# Altium schematic sheet 1_power.SchDoc: Power
size A4; DocumentNumber: 2; SheetNumber: 2; SheetTotal: 11
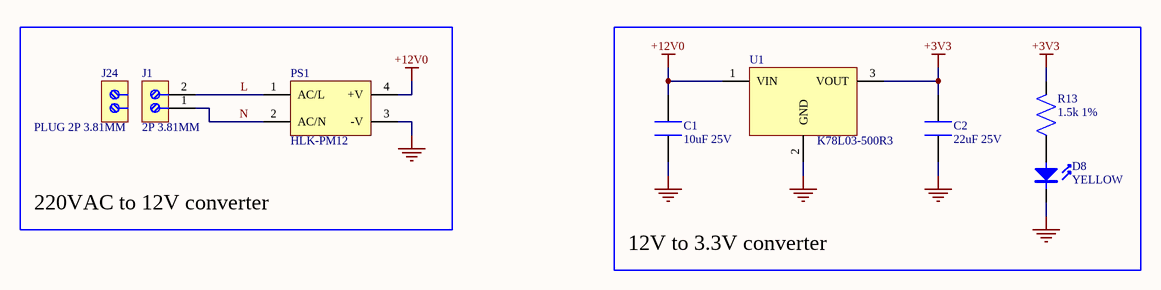
[diagram p0: 1_power.SchDoc]

## Parts
C1  10uF 25V  [C0805]
C2  22uF 25V  [C0805]
D8  YELLOW  [LED0603-YELLOW]
J1  2P 3.81MM  [TB-2P-3.81MM]  (no BOM)
J24  PLUG 2P 3.81MM  [TB-PLUG-2P-3.81MM]  (no BOM)
PS1  HLK-PM12  [HLK-PM12]
R13  1.5k 1%  [R0603]
U1  K78L03-500R3  [K78LXX-500R3]

## Blocks framed on the sheet
220VAC to 12V converter: J1 J24 PS1
12V to 3.3V converter: C1 C2 D8 R13 U1

## Nets
+3V3: C2.1 R13.2 U1.3(VOUT)
+12V0: C1.1 PS1.4(+V) U1.1(VIN)
GND: C1.2 C2.2 D8.1 PS1.3(-V) U1.2(GND)
L: J1.2 PS1.1(AC/L)
N: J1.1 PS1.2(AC/N)
NetD8_2: D8.2 R13.1

## Notes on the sheet
- Title
- Size:
- Date:
- A4
- Number:
- Time:
- Revision:
- Sheet
- of
- SmartyBoy
- alkonosst
- github.com/alkonosst <http://github.com/alkonosst>
- Designer:

## Library data of the parts
C1 = CL21A106KAYNNNE: X5R 25V ±10% 10uF 0805 Multilayer Ceramic Capacitors MLCC - SMD/SMT; LCSC part: C15850; Category: Capacitors: Multilayer Ceramic Capacitors MLCC - SMD/SMT
C2 = CL21A226MAQNNNE: X5R 25V ±20% 22uF 0805 Multilayer Ceramic Capacitors MLCC - SMD/SMT; LCSC part: C45783; Category: Capacitors: Multilayer Ceramic Capacitors MLCC - SMD/SMT
D8 = 19-213/Y2C-CQ2R2L/3T(CY): Yellow 585.5~591.5nm 0603 Light Emitting Diodes (LED); LCSC part: C72038; Category: Optoelectronics: Light Emitting Diodes (LED)
J1 = TBLOCK-2P-3.81MM: Terminal Block 2 Positions 3.81MM; Category: Connectors: Pluggable System Terminal Block
J24 = PLUG-2P-3.81MM: Terminal block plug 2positions 3.81mm; Category: Connectors: Pluggable System Terminal Block
PS1 = HLK-PM12: 220VAC to 12VDC Power Module 3W; LCSC part: C209905; Category: Power Management ICs: Power Modules
R13 = 0603WAF1501T5E: 1.5kΩ ±1% ±100ppm/℃ 0.1W 0603 Chip Resistor - Surface Mount; LCSC part: C22843; Category: Resistors: Chip Resistor - Surface Mount
U1 = K78L03-500R3: 36V 500mA 3.3V 1 SIP Power Modules; LCSC part: C115818; Category: Power Management ICs: Power Modules